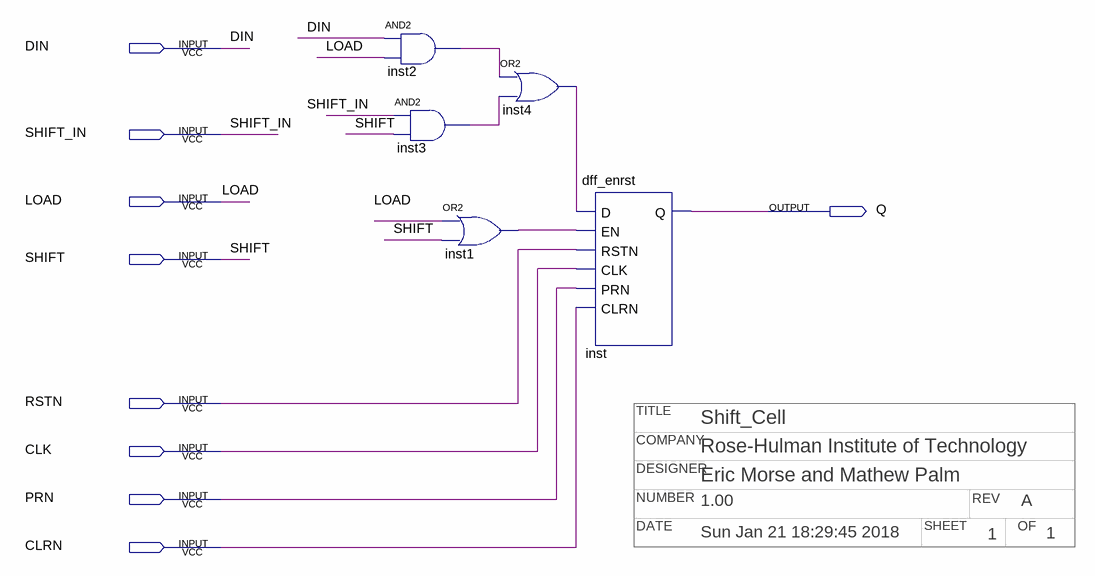
[diagram p0: schematic sheet]
// Quartus schematic shift_cell.bdf as structural Verilog: 5 symbols, 9 pins
// Title block: COMPANY: Rose-Hulman Institute of Technology; DATE: Sun Jan 21 18:29:45 2018; DESIGNER: Eric Morse and Mathew Palm; NUMBER: 1.00; OF: 1; REV: A; SHEET: 1; TITLE: Shift_Cell
module shift_cell (
  input  DIN,
  input  SHIFT_IN,
  input  LOAD,
  input  SHIFT,
  input  RSTN,
  input  CLK,
  input  PRN,
  input  CLRN,
  output Q
);

  wire inst1_out, inst2_out, inst3_out, inst4_out;

  and inst2 (inst2_out, DIN, LOAD);
  and inst3 (inst3_out, SHIFT_IN, SHIFT);
  or inst1 (inst1_out, LOAD, SHIFT);
  or inst4 (inst4_out, inst2_out, inst3_out);
  dff_enrst inst (.D(inst4_out), .EN(inst1_out), .RSTN(RSTN), .CLK(CLK), .PRN(PRN), .CLRN(CLRN), .Q(Q));
endmodule
